# EAGLE schematic Continuity_Tester (EAGLE 9.1.0)
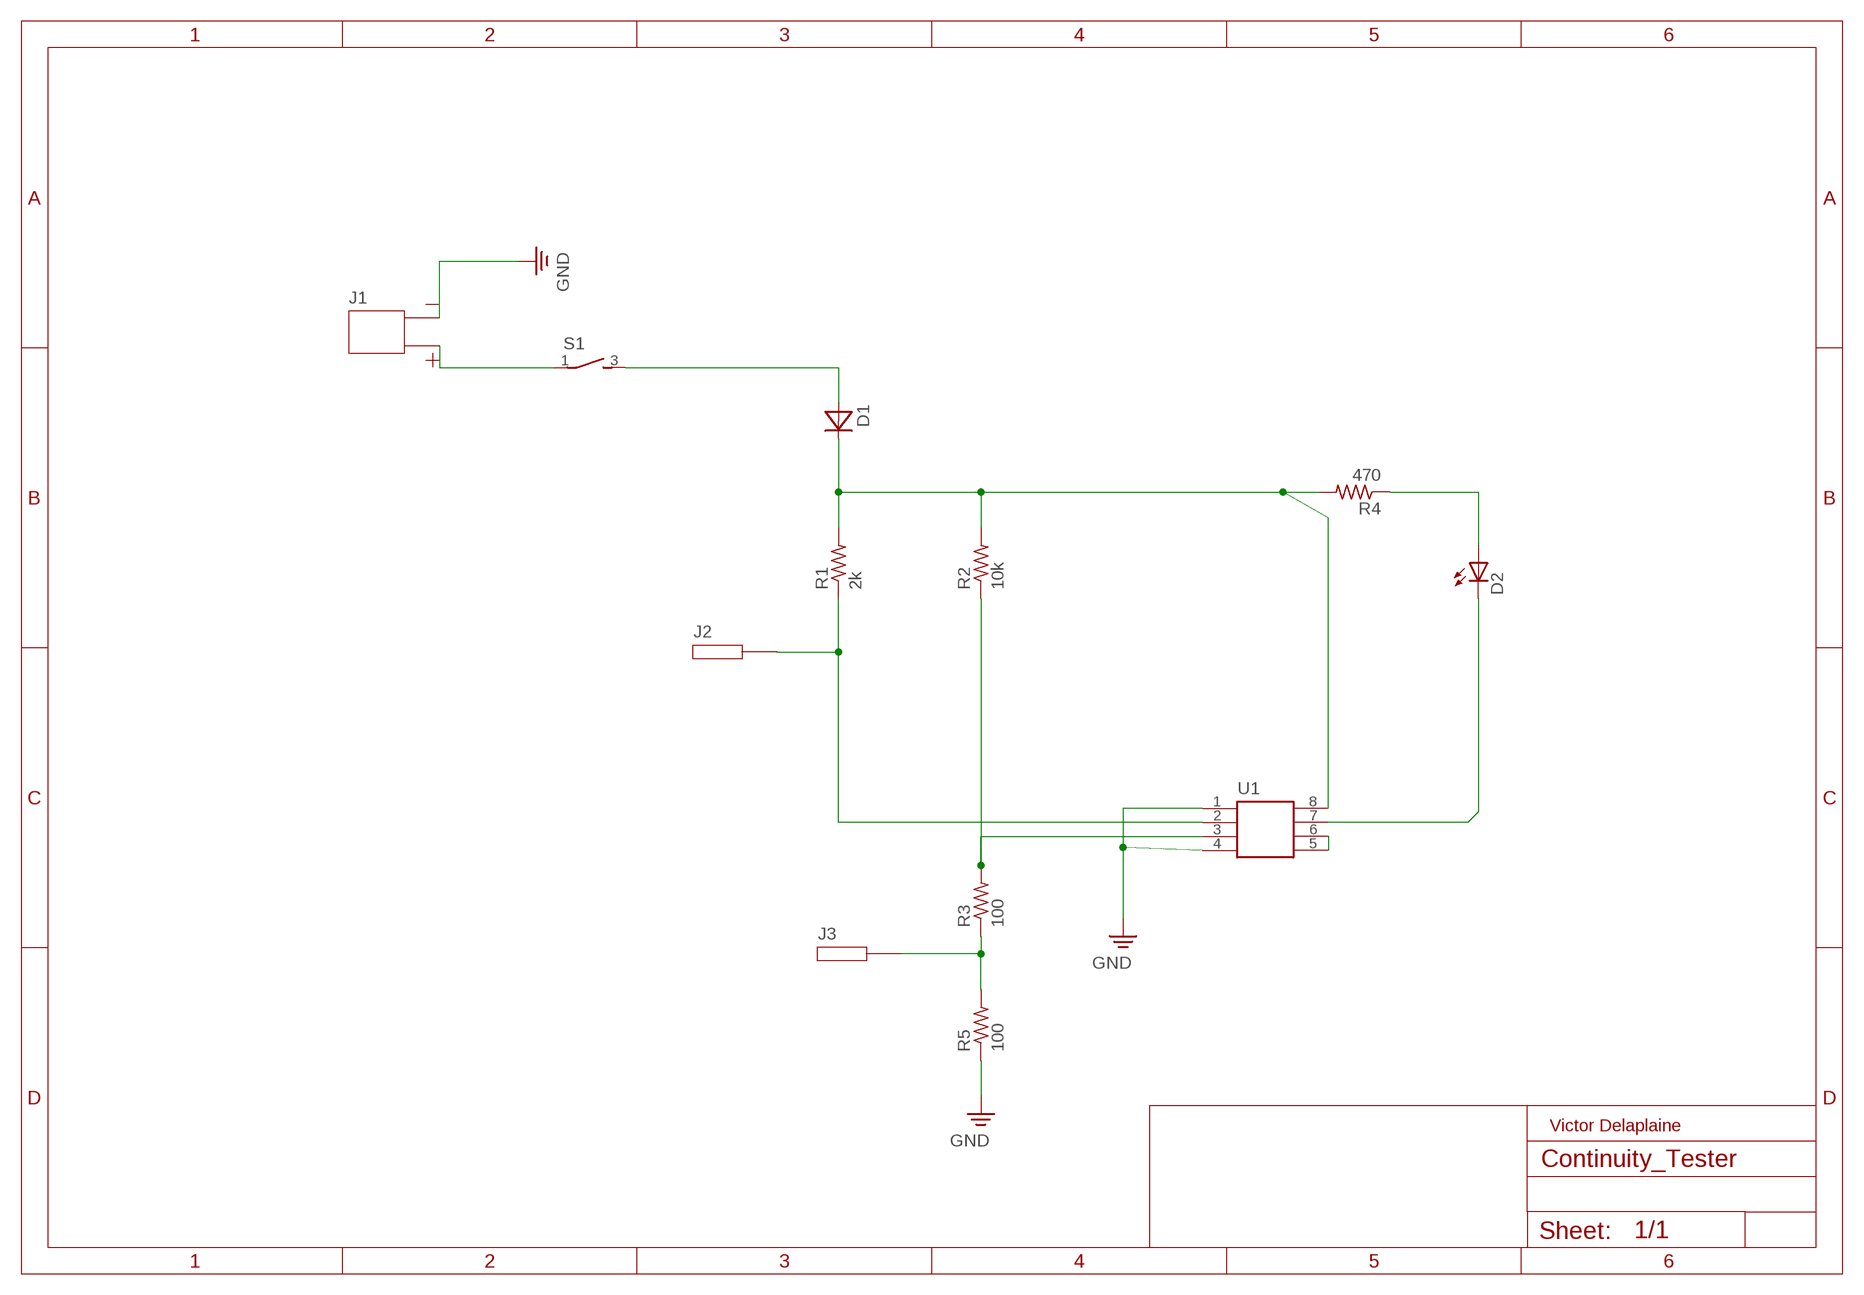
[diagram p0: schematic, sheet 1]

## Parts
D1  DIODE  [DIODE-FOOT]
D2  LED  [LED-FOOT]
J1  POWER  [POWER-FOOT]
J2  ALLIGATORCLIP  [ALLIGATORCLIP-FOOT]
J3  ALLIGATORCLIP  [ALLIGATORCLIP-FOOT]
R1  2k  RES  [RES-FOOT]
R2  10k  RES  [RES-FOOT]
R3  100  RES  [RES-FOOT]
R4  470  RES  [RES-FOOT]
R5  100  RES  [RES-FOOT]
S1  SWITCH  [SWITCH-FOOT]
U1  LM311M  [LM311M-FOOT]

## Nets
N$1: J1.2 S1.1
N$2: D1.A S1.3
N$3: D1.C R1.2 R2.2 R4.2 U1.8
N$4: J2.1 R1.1 U1.2
N$6: J3.1 R3.1 R5.2
N$7: D2.A R4.1
N$8: D2.C U1.7
N$9: U1.5 U1.6
N$10: R2.1 R3.2 U1.3
PE: J1.1 R5.1 U1.1 U1.4 ; supply symbol labelled GND

## Notes on the sheet
- Victor Delaplaine

## Library data of the parts
D1 = lab1:DIODE
D2 = lab1:LED
J1 = lab1:POWER
J2 J3 = lab1:ALLIGATORCLIP
R1-R5 = lab1:RES
S1 = lab1:SWITCH
U1 = lab1:LM311M